# Altium project retroBreadboard_v1i1.PrjPCB
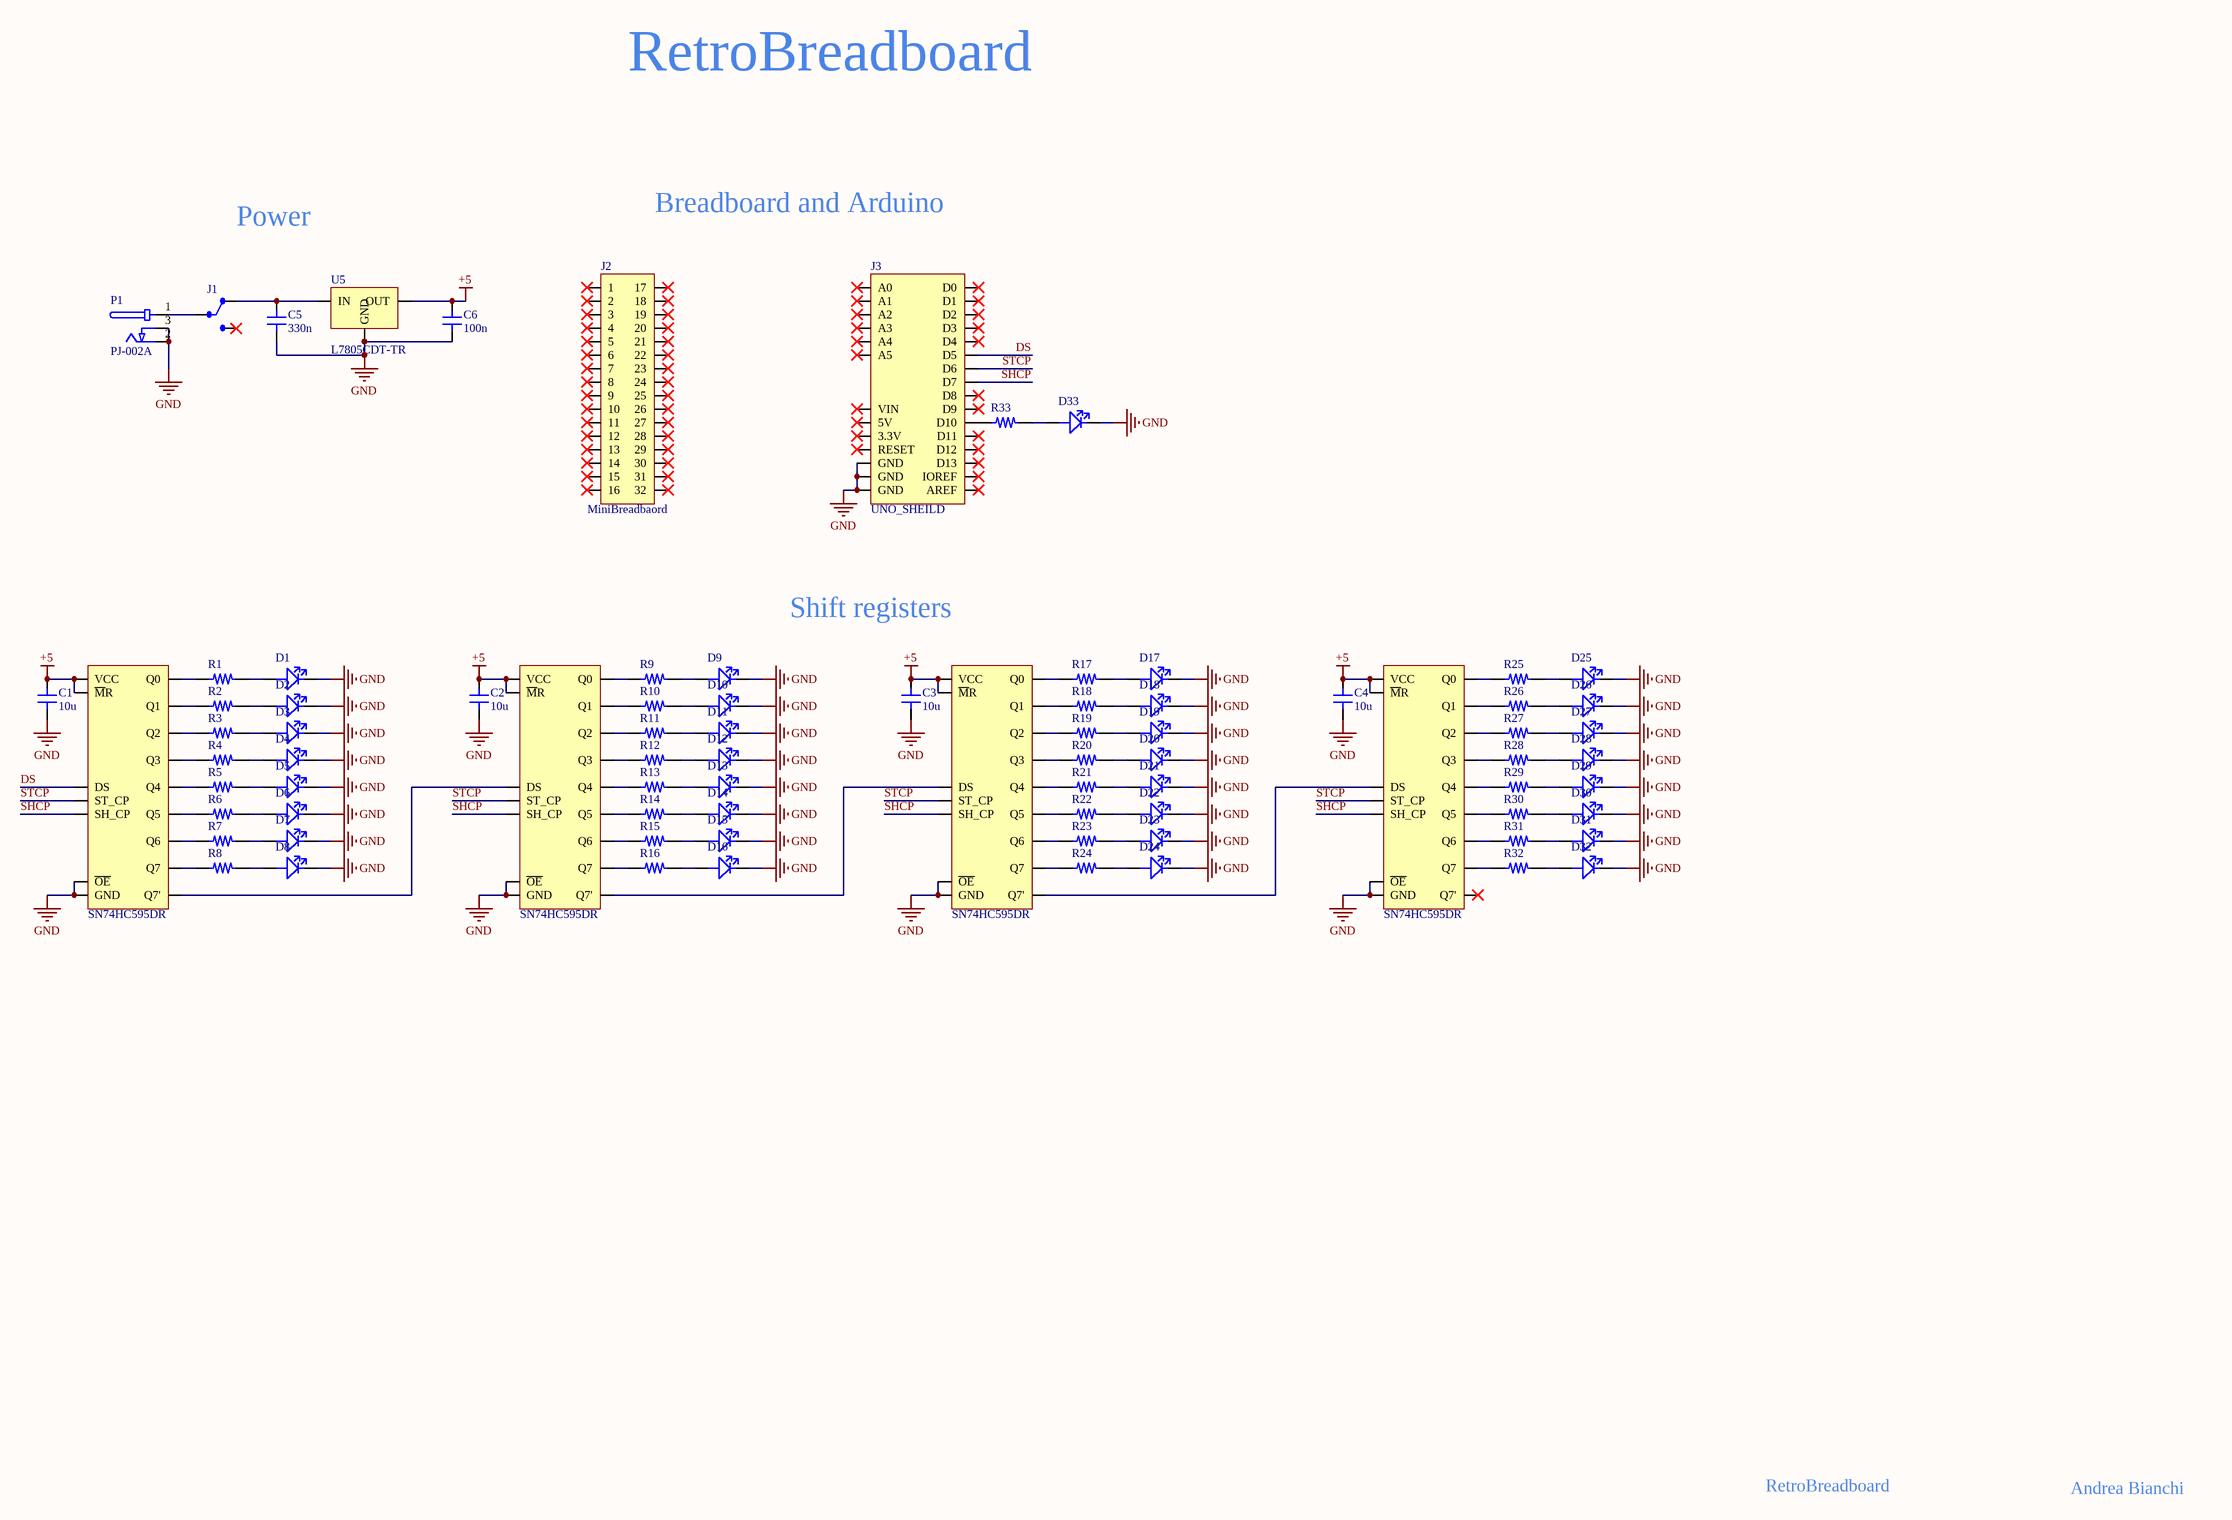
[diagram p0: retroBreadboard_v1i1.SchDoc]
1 sheet, 81 parts. Net scope: global (net labels, ports and power ports of the same name join across sheets).
Board files: retroBreadboard_v1i1.PcbDoc, retroBreadboard_v2i1.PcbDoc

## Sheet retroBreadboard_v1i1.SchDoc
size A2

### Parts
C1  10u  [C0805]
C2  10u  [C0805]
C3  10u  [C0805]
C4  10u  [C0805]
C5  330n  [C0805]
C6  100n  [C0805]
D1  VLMB1500-GS08  [VLMB1500-GS08]  (value not drawn)
D2  VLMB1500-GS08  [VLMB1500-GS08]  (value not drawn)
D3  VLMB1500-GS08  [VLMB1500-GS08]  (value not drawn)
D4  VLMB1500-GS08  [VLMB1500-GS08]  (value not drawn)
D5  VLMB1500-GS08  [VLMB1500-GS08]  (value not drawn)
D6  VLMB1500-GS08  [VLMB1500-GS08]  (value not drawn)
D7  VLMB1500-GS08  [VLMB1500-GS08]  (value not drawn)
D8  VLMB1500-GS08  [VLMB1500-GS08]  (value not drawn)
D9  VLMB1500-GS08  [VLMB1500-GS08]  (value not drawn)
D10  VLMB1500-GS08  [VLMB1500-GS08]  (value not drawn)
D11  VLMB1500-GS08  [VLMB1500-GS08]  (value not drawn)
D12  VLMB1500-GS08  [VLMB1500-GS08]  (value not drawn)
D13  VLMB1500-GS08  [VLMB1500-GS08]  (value not drawn)
D14  VLMB1500-GS08  [VLMB1500-GS08]  (value not drawn)
D15  VLMB1500-GS08  [VLMB1500-GS08]  (value not drawn)
D16  VLMB1500-GS08  [VLMB1500-GS08]  (value not drawn)
D17  VLMB1500-GS08  [VLMB1500-GS08]  (value not drawn)
D18  VLMB1500-GS08  [VLMB1500-GS08]  (value not drawn)
D19  VLMB1500-GS08  [VLMB1500-GS08]  (value not drawn)
D20  VLMB1500-GS08  [VLMB1500-GS08]  (value not drawn)
D21  VLMB1500-GS08  [VLMB1500-GS08]  (value not drawn)
D22  VLMB1500-GS08  [VLMB1500-GS08]  (value not drawn)
D23  VLMB1500-GS08  [VLMB1500-GS08]  (value not drawn)
D24  VLMB1500-GS08  [VLMB1500-GS08]  (value not drawn)
D25  VLMB1500-GS08  [VLMB1500-GS08]  (value not drawn)
D26  VLMB1500-GS08  [VLMB1500-GS08]  (value not drawn)
D27  VLMB1500-GS08  [VLMB1500-GS08]  (value not drawn)
D28  VLMB1500-GS08  [VLMB1500-GS08]  (value not drawn)
D29  VLMB1500-GS08  [VLMB1500-GS08]  (value not drawn)
D30  VLMB1500-GS08  [VLMB1500-GS08]  (value not drawn)
D31  VLMB1500-GS08  [VLMB1500-GS08]  (value not drawn)
D32  VLMB1500-GS08  [VLMB1500-GS08]  (value not drawn)
D33  VLMB1500-GS08  [VLMB1500-GS08]  (value not drawn)
J1  500SSP1S1M6QEA  [SLIDE SPDT]  (value not drawn)
J2  MiniBreadbaord  [MINI_BREADBOARD HOLE]
J3  UNO_SHEILD  [ARDUINO_UNO_SHIELD]
P1  PJ-002A  [PJ-002A]
R1  RC0402FR-07200RL  [RES0402]  (value not drawn)
R2  RC0402FR-07200RL  [RES0402]  (value not drawn)
R3  RC0402FR-07200RL  [RES0402]  (value not drawn)
R4  RC0402FR-07200RL  [RES0402]  (value not drawn)
R5  RC0402FR-07200RL  [RES0402]  (value not drawn)
R6  RC0402FR-07200RL  [RES0402]  (value not drawn)
R7  RC0402FR-07200RL  [RES0402]  (value not drawn)
R8  RC0402FR-07200RL  [RES0402]  (value not drawn)
R9  RC0402FR-07200RL  [RES0402]  (value not drawn)
R10  RC0402FR-07200RL  [RES0402]  (value not drawn)
R11  RC0402FR-07200RL  [RES0402]  (value not drawn)
R12  RC0402FR-07200RL  [RES0402]  (value not drawn)
R13  RC0402FR-07200RL  [RES0402]  (value not drawn)
R14  RC0402FR-07200RL  [RES0402]  (value not drawn)
R15  RC0402FR-07200RL  [RES0402]  (value not drawn)
R16  RC0402FR-07200RL  [RES0402]  (value not drawn)
R17  RC0402FR-07200RL  [RES0402]  (value not drawn)
R18  RC0402FR-07200RL  [RES0402]  (value not drawn)
R19  RC0402FR-07200RL  [RES0402]  (value not drawn)
R20  RC0402FR-07200RL  [RES0402]  (value not drawn)
R21  RC0402FR-07200RL  [RES0402]  (value not drawn)
R22  RC0402FR-07200RL  [RES0402]  (value not drawn)
R23  RC0402FR-07200RL  [RES0402]  (value not drawn)
R24  RC0402FR-07200RL  [RES0402]  (value not drawn)
R25  RC0402FR-07200RL  [RES0402]  (value not drawn)
R26  RC0402FR-07200RL  [RES0402]  (value not drawn)
R27  RC0402FR-07200RL  [RES0402]  (value not drawn)
R28  RC0402FR-07200RL  [RES0402]  (value not drawn)
R29  RC0402FR-07200RL  [RES0402]  (value not drawn)
R30  RC0402FR-07200RL  [RES0402]  (value not drawn)
R31  RC0402FR-07200RL  [RES0402]  (value not drawn)
R32  RC0402FR-07200RL  [RES0402]  (value not drawn)
R33  RC0402FR-07200RL  [RES0402]  (value not drawn)
U1  SN74HC595DR  [SOIC16]
U2  SN74HC595DR  [SOIC16]
U3  SN74HC595DR  [SOIC16]
U4  SN74HC595DR  [SOIC16]
U5  L7805CDT-TR  [DPAK]

### Nets
+5: C1.2 C2.2 C3.2 C4.2 C6.2 U1.10(~{M}R) U1.16(VCC) U2.10(~{M}R) U2.16(VCC) U3.10(~{M}R) U3.16(VCC) U4.10(~{M}R) U4.16(VCC) U5.3(OUT)
GND: C1.1 C2.1 C3.1 C4.1 C5.1 C6.1 D1.2(K) D2.2(K) D3.2(K) D4.2(K) D5.2(K) D6.2(K) D7.2(K) D8.2(K) D9.2(K) D10.2(K) D11.2(K) D12.2(K) D13.2(K) D14.2(K) D15.2(K) D16.2(K) D17.2(K) D18.2(K) D19.2(K) D20.2(K) D21.2(K) D22.2(K) D23.2(K) D24.2(K) D25.2(K) D26.2(K) D27.2(K) D28.2(K) D29.2(K) D30.2(K) D31.2(K) D32.2(K) D33.2(K) J3.15(GND) J3.24(GND) J3.25(GND) P1.2 P1.3 U1.8(GND) U1.13(~{OE}) U2.8(GND) U2.13(~{OE}) U3.8(GND) U3.13(~{OE}) U4.8(GND) U4.13(~{OE}) U5.4(GND)
DS: J3.6(D5) U1.14(DS)
SHCP: J3.8(D7) U1.11(SH_CP) U2.11(SH_CP) U3.11(SH_CP) U4.11(SH_CP)
STCP: J3.7(D6) U1.12(ST_CP) U2.12(ST_CP) U3.12(ST_CP) U4.12(ST_CP)
NetC5_2: C5.2 J1.1 U5.1(IN)
NetD1_1: D1.1(A) R1.2
NetD2_1: D2.1(A) R2.2
NetD3_1: D3.1(A) R3.2
NetD4_1: D4.1(A) R4.2
NetD5_1: D5.1(A) R5.2
NetD6_1: D6.1(A) R6.2
NetD7_1: D7.1(A) R7.2
NetD8_1: D8.1(A) R8.2
NetD9_1: D9.1(A) R9.2
NetD10_1: D10.1(A) R10.2
NetD11_1: D11.1(A) R11.2
NetD12_1: D12.1(A) R12.2
NetD13_1: D13.1(A) R13.2
NetD14_1: D14.1(A) R14.2
NetD15_1: D15.1(A) R15.2
NetD16_1: D16.1(A) R16.2
NetD17_1: D17.1(A) R17.2
NetD18_1: D18.1(A) R18.2
NetD19_1: D19.1(A) R19.2
NetD20_1: D20.1(A) R20.2
NetD21_1: D21.1(A) R21.2
NetD22_1: D22.1(A) R22.2
NetD23_1: D23.1(A) R23.2
NetD24_1: D24.1(A) R24.2
NetD25_1: D25.1(A) R25.2
NetD26_1: D26.1(A) R26.2
NetD27_1: D27.1(A) R27.2
NetD28_1: D28.1(A) R28.2
NetD29_1: D29.1(A) R29.2
NetD30_1: D30.1(A) R30.2
NetD31_1: D31.1(A) R31.2
NetD32_1: D32.1(A) R32.2
NetD33_1: D33.1(A) R33.2
NetJ1_2: J1.2 P1.1
NetJ3_11: J3.11(D10) R33.1
NetR1_1: R1.1 U1.15(Q0)
NetR2_1: R2.1 U1.1(Q1)
NetR3_1: R3.1 U1.2(Q2)
NetR4_1: R4.1 U1.3(Q3)
NetR5_1: R5.1 U1.4(Q4)
NetR6_1: R6.1 U1.5(Q5)
NetR7_1: R7.1 U1.6(Q6)
NetR8_1: R8.1 U1.7(Q7)
NetR9_1: R9.1 U2.15(Q0)
NetR10_1: R10.1 U2.1(Q1)
NetR11_1: R11.1 U2.2(Q2)
NetR12_1: R12.1 U2.3(Q3)
NetR13_1: R13.1 U2.4(Q4)
NetR14_1: R14.1 U2.5(Q5)
NetR15_1: R15.1 U2.6(Q6)
NetR16_1: R16.1 U2.7(Q7)
NetR17_1: R17.1 U3.15(Q0)
NetR18_1: R18.1 U3.1(Q1)
NetR19_1: R19.1 U3.2(Q2)
NetR20_1: R20.1 U3.3(Q3)
NetR21_1: R21.1 U3.4(Q4)
NetR22_1: R22.1 U3.5(Q5)
NetR23_1: R23.1 U3.6(Q6)
NetR24_1: R24.1 U3.7(Q7)
NetR25_1: R25.1 U4.15(Q0)
NetR26_1: R26.1 U4.1(Q1)
NetR27_1: R27.1 U4.2(Q2)
NetR28_1: R28.1 U4.3(Q3)
NetR29_1: R29.1 U4.4(Q4)
NetR30_1: R30.1 U4.5(Q5)
NetR31_1: R31.1 U4.6(Q6)
NetR32_1: R32.1 U4.7(Q7)
NetU1_9: U1.9(Q7') U2.14(DS)
NetU2_9: U2.9(Q7') U3.14(DS)
NetU3_9: U3.9(Q7') U4.14(DS)

Not connected (* = marked no-connect by the designer): J1 3*; J2 1* 2* 3* 4* 5* 6* 7* 8* 9* 10* 11* 12* 13* 14* 15* 16* 17* 18* 19* 20* 21* 22* 23* 24* 25* 26* 27* 28* 29* 30* 31* 32*; J3 1(D0)* 2(D1)* 3(D2)* 4(D3)* 5(D4)* 9(D8)* 10(D9)* 12(D11)* 13(D12)* 14(D13)* 16(AREF)* 17(A5)* 18(A4)* 19(A3)* 20(A2)* 21(A1)* 22(A0)* 23(VIN)* 26(5V)* 27(3.3V)* 28(RESET)* 29(IOREF)*; U4 9(Q7')*

### Notes on the sheet
- RetroBreadboard
- Power
- Breadboard and Arduino
- Shift registers
- Andrea Bianchi
- Title
- Size:
- Date:
- File:
- A2
- Number:
- Time:
- Revision:
- Sheet
- of

### Library data of the parts
C1-C4 = C0805_10u: Manufacturer: Samsung; Manufacturer Part Number: CL21A106KQFNNNG; Material: Ceramic; Tolerance: 10%; Capacitance: 10uF; Voltage Rating: 6.3V; Dielectric: X5R; Supplier 1: Digi-Key; Stock 1: 53378; RoHS: Yes; Mount: Surface Mount; Case/Package: 0805; Case Code (Metric): 2012; Case Code (Imperial): 0805; Min Operating Temperature: -55°C; Max Operating Temperature: 85°C; Packaging: Tape and Reel; Package Quantity: 3000; Voltage: 6.3V; Length: 2mm; Height: 1.25mm; Width: 0.049inch; Thickness: 0.053inch; Depth: 1.25mm; Lead Free: Lead Free; ComponentLink1URL: http://www.samsungsem.com/kr/support/product-search/mlcc/CL21A106KQFNNNG.jsp?src-supplier=Digi-Key; ComponentLink1Description: http://www.samsungsem.com/kr/support/product-search/mlcc/CL21A106KQFNNNG.jsp?src-supplier=Digi-Key; ComponentLink2URL: https://produktinfo.conrad.com/datenblaetter/450000-474999/454985-da-01-en-VS_KONDENSATOR_0805.pdf?src-supplier=Conrad; ComponentLink2Description: https://produktinfo.conrad.com/datenblaetter/450000-474999/454985-da-01-en-VS_KONDENSATOR_0805.pdf?src-supplier=Conrad; Supplier Part Number 1: 1276-6457-1-ND; Pricing 1: 1 = 0.13000, 10 = 0.09600, 100 = 0.04270, 500 = 0.03054, 1000 = 0.02399 (USD)
C5 = C0805_330n: Manufacturer: Samsung; Manufacturer Part Number: CL21B334KAFNNNG; Material: Ceramic; Tolerance: 10%; Capacitance: 330nF; Voltage Rating: 25V; Dielectric: X7R; Supplier 1: Digi-Key; Stock 1: 834; RoHS: Yes; Mount: Surface Mount; Case/Package: 0805; Case Code (Metric): 2012; Case Code (Imperial): 0805; Min Operating Temperature: -55°C; Max Operating Temperature: 125°C; Package Quantity: 3000; Packaging: Tape and Reel; Voltage: 25V; Length: 2mm; Height: 1.25mm; Width: 0.049inch; Thickness: 0.053inch; Depth: 1.25mm; Lead Free: Lead Free; ComponentLink1URL: https://www.distrelec.biz/Web/Downloads/_e/ng/MLCC_CatalogDownload2013_ENG.pdf?mime=application%2Fpdf&src-supplier=Distrelec; ComponentLink1Description: https://www.distrelec.biz/Web/Downloads/_e/ng/MLCC_CatalogDownload2013_ENG.pdf?mime=application%2Fpdf&src-supplier=Distrelec; ComponentLink2URL: http://www.samsungsem.com/global/support/library/product-catalog/__icsFiles/afieldfile/2014/11/13/MLCC.pdf?src-supplier=Digi-Key; ComponentLink2Description: http://www.samsungsem.com/global/support/library/product-catalog/__icsFiles/afieldfile/2014/11/13/MLCC.pdf?src-supplier=Digi-Key; ComponentLink3URL: http://www1.futureelectronics.com/doc/SAMSUNG%20PASSIVE/CL05B104KQ5NNNC.pdf?src-supplier=Future+Electronics; ComponentLink3Description: http://www1.futureelectronics.com/doc/SAMSUNG%20PASSIVE/CL05B104KQ5NNNC.pdf?src-supplier=Future+Electronics; Supplier Part Number 1: 1276-6479-1-ND; Pricing 1: 1 = 0.12000, 10 = 0.08600, 100 = 0.03810, 500 = 0.02722, 1000 = 0.02138 (USD)
C6 = C0805_100n: Manufacturer: Samsung; Manufacturer Part Number: CL21F104ZBCNNNC; Material: Ceramic; Capacitance: 100nF; Tolerance: 80%; Dielectric: Y5V; Voltage Rating: 50V; Supplier 1: Digi-Key; Stock 1: 117334; RoHS: Yes; Mount: Surface Mount; Case/Package: 0805; Case Code (Metric): 2012; Case Code (Imperial): 0805; Min Operating Temperature: -30°C; Max Operating Temperature: 85°C; Packaging: Tape and Reel; Package Quantity: 1; Length: 2mm; Height: 0.85mm; Width: 0.049inch; Thickness: 0.037inch; Depth: 1.25mm; Radiation Hardening: No; ComponentLink1URL: https://www.verical.com/server-webapp/html/getDatasheet?partID=466953&src-supplier=Verical; ComponentLink1Description: https://www.verical.com/server-webapp/html/getDatasheet?partID=466953&src-supplier=Verical; ComponentLink2URL: https://produktinfo.conrad.com/datenblaetter/450000-474999/454191-da-01-en-VS_KONDENSATOR_0805.pdf?src-supplier=Conrad; ComponentLink2Description: https://produktinfo.conrad.com/datenblaetter/450000-474999/454191-da-01-en-VS_KONDENSATOR_0805.pdf?src-supplier=Conrad; Supplier Part Number 1: 1276-1007-1-ND; Pricing 1: 1 = 0.10000, 10 = 0.04400, 100 = 0.01950, 500 = 0.01390, 1000 = 0.01092 (USD)
D1-D33 = VLMB1500-GS08: Standard LEDs - SMD 0402 BLUE Non-Diff; Manufacturer: Vishay; Lens Colour: Clear; Luminous Intensity: 45mcd; Forward Current: 30mA; Viewing Angle: 130°; Forward Voltage: 3.15V; Dominant Wavelength: 470nm; Test Current: 5mA; Number of Elements: 1; Power Dissipation: 76mW; Lens Style: Rectangular; Power Rating: 75mW; Supplier 1: Digi-Key; Manufacturer Part Number: VLMB1500-GS08; Stock 1: 322508; Mount: Surface Mount; Case/Package: 0402; Number of Pins: 2; Colour: Blue; Case Code (Metric): 1005; Case Code (Imperial): 0402; Contact Plating: Matte,Tin; Min Operating Temperature: -30°C; Max Operating Temperature: 80°C; Packaging: Tape and Reel; Package Quantity: 1; Illumination Colour: Blue; Max Power Dissipation: 76mW; Number of LEDs: 1; Length: 1mm; Height: 0.35mm; Width: 0.5mm; Depth: 0.5mm; Radiation Hardening: No; REACH SVHC: Unknown; Lead Free: Lead Free; ComponentLink1URL: http://www.vishay.com/docs/82554/vlmo1500.pdf; ComponentLink1Description: http://www.vishay.com/docs/82554/vlmo1500.pdf; Supplier Part Number 1: VLMB1500-GS08DKR-ND; Pricing 1: 1=0.41, 10=0.292, 25=0.2532, 100=0.1949, 250=0.15836, 500=0.11696, 1000=0.09746 (USD)
J1 = SLIDE SPDT: SWITCH SLIDE SPDT 5A 120V; Manufacturer: E-Switch; Mechanical Life: 30000Cycles; Actuator Material: Nylon,Polyamide; Max Voltage Rating (AC): 250V; Voltage Rating (DC): 28V; Contact Resistance: 10mR; Switch Travel: 2.16mm; Switch Function: On-On; Actuator Length: 4.72mm; Supplier 1: Digi-Key; Manufacturer Part Number: 500SSP1S1M6QEA; Stock 1: 6111; Mount: Through Hole,Brackets; Contact Plating: Silver; Contact Material: Copper,Silver,Copper Alloy; Housing Material: Stainless Steel; Min Operating Temperature: -30°C; Max Operating Temperature: 85°C; Contact Current Rating: 5A; Voltage Rating (AC): 120V; Throw Configuration: SPDT; Package Quantity: 1; Packaging: Bulk; Current Rating: 5A; Max Voltage Rating (DC): 28V; Termination: PC Pin; Electrical Life: 30000Cycles; Orientation: Right Angle; REACH SVHC: Unknown; Lead Free: Lead Free; Flammability Rating: UL94 V-0; ComponentLink1URL: https://datasheet.ciiva.com/16337/500-16337624.pdf; ComponentLink1Description: https://datasheet.ciiva.com/16337/500-16337624.pdf; ComponentLink2URL: https://datasheet.ciiva.com/16174/35500-16174234.pdf; ComponentLink2Description: https://datasheet.ciiva.com/16174/35500-16174234.pdf; ComponentLink3URL: https://datasheet.ciiva.com/2889/t511006d-2889419.pdf; ComponentLink3Description: https://datasheet.ciiva.com/2889/t511006d-2889419.pdf; Supplier Part Number 1: EG2478-ND; Pricing 1: 1=2.93, 10=2.808, 25=2.7484, 50=2.39, 100=2.3303, 250=2.27052, 500=1.912, 1000=1.7925, 5000=1.64313 (USD)
J2 = MINI_BREADBOARD: Mini Breadboard; Manufacturer: TE Connectivity AMP; Manufacturer Part Number: 1738132-1; Gender: Male; Supplier 1: Digi-Key; Stock 1: 0; Colour: Natural; ComponentLink1URL: http://www.te.com/commerce/DocumentDelivery/DDEController?Action=srchrtrv&DocNm=1738132&DocType=Customer+Drawing&DocLang=English; ComponentLink1Description: http://www.te.com/commerce/DocumentDelivery/DDEController?Action=srchrtrv&DocNm=1738132&DocType=Customer+Drawing&DocLang=English; Supplier Part Number 1: 1738132-1-ND
J3 = ARDUINO_UNO_SHIELD
P1 = PJ-002A: PJ-002 Series 2 x 6.5 mm 16 V Right Angle Through Hole Power Jack; Manufacturer: CUI; Gender: Male; Shielding: Unshielded; Current Rating: 2.5A; Voltage Rating: 24V; Insulation Resistance: 50MR; Number of Conductors: 2; Supplier 1: Digi-Key; Manufacturer Part Number: PJ-002A; Stock 1: 133077; Mount: Through Hole; Contact Material: Copper,Copper Alloy; Contact Plating: Nickel,Tin; Housing Colour: Black; Housing Material: Thermoplastic; Colour: Black; Min Operating Temperature: -25°C; Max Operating Temperature: 85°C; Termination: Through Hole; Connector Type: Jack; Packaging: Bulk; Package Quantity: 500; Contact Gender: Male; Orientation: Horizontal; Diameter: 2.1mm; Lead Free: Lead Free; Flammability Rating: UL94 V-0; ComponentLink1URL: http://www.cui.com/product/resource/digikeypdf/pj-002a.pdf; ComponentLink1Description: http://www.cui.com/product/resource/digikeypdf/pj-002a.pdf; ComponentLink2URL: http://www.cui.com/Product/Resource/FuturePDF/PJ-002A.pdf; ComponentLink2Description: http://www.cui.com/Product/Resource/FuturePDF/PJ-002A.pdf; ComponentLink3URL: http://www.mouser.com/ds/2/670/pj-002a-515880.pdf; ComponentLink3Description: http://www.mouser.com/ds/2/670/pj-002a-515880.pdf; Supplier Part Number 1: CP-002A-ND
R1-R33 = R0402_200: RES SMD 200 OHM 1% 1/16W 0402; Manufacturer: Yageo; Resistance: 200R; Power Rating: 63mW; Voltage Rating: 50V; Temperature Coefficient: 100ppm/°C; Supplier 1: Digi-Key; Manufacturer Part Number: RC0402FR-07200RL; Stock 1: 7546584; RoHS: Yes; Case/Package: 0402; Case Code (Metric): 1005; Case Code (Imperial): 0402; Min Operating Temperature: -55°C; Max Operating Temperature: 155°C; Tolerance: 1%; Packaging: Tape and Reel; Package Quantity: 1; Composition: Thick Film; Number of Terminations: 2; Termination: SMD/SMT; Military Standard: Not; Max Power Dissipation: 63mW; Voltage Rating (DC): 50V; Features: Moisture Resistant; Length: 1mm; Height: 0.016inch; Width: 0.02inch; Depth: 0.5mm; REACH SVHC: No SVHC; Lead Free: Lead Free; ComponentLink1URL: http://www.yageo.com/documents/recent/PYu-RC_Group_51_RoHS_L_10.pdf?src-supplier=Digi-Key; ComponentLink1Description: http://www.yageo.com/documents/recent/PYu-RC_Group_51_RoHS_L_10.pdf?src-supplier=Digi-Key; ComponentLink2URL: http://www.farnell.com/datasheets/1018594.pdf?src-supplier=Element14; ComponentLink2Description: http://www.farnell.com/datasheets/1018594.pdf?src-supplier=Element14; ComponentLink3URL: http://www.yageo.com/documents/recent/PYu-RC0402_51_RoHS_L_6_r.pdf?src-supplier=Future+Electronics; ComponentLink3Description: http://www.yageo.com/documents/recent/PYu-RC0402_51_RoHS_L_6_r.pdf?src-supplier=Future+Electronics; ComponentLink4URL: https://www.verical.com/server-webapp/html/getDatasheet?partID=331152&src-supplier=Verical; ComponentLink4Description: https://www.verical.com/server-webapp/html/getDatasheet?partID=331152&src-supplier=Verical; ComponentLink5URL: http://www.farnell.com/datasheets/2167052.pdf?src-supplier=Element14; ComponentLink5Description: http://www.farnell.com/datasheets/2167052.pdf?src-supplier=Element14; ComponentLink6URL: http://www.yageo.com/documents/recent/PYu-RC0402_51_RoHS_L_6_r.pdf?src-supplier=Mouser; ComponentLink6Description: http://www.yageo.com/documents/recent/PYu-RC0402_51_RoHS_L_6_r.pdf?src-supplier=Mouser; Supplier Part Number 1: 311-200LRCT-ND; Pricing 1: 1 = 0.10000, 10 = 0.01600, 100 = 0.00670, 1000 = 0.00301, 2500 = 0.00261, 5000 = 0.00215 (USD)
U1-U4 = 74HC595: IC, SM, LOGIC, 74HC, REGISTER; Manufacturer: Texas Instruments; Direction: Unidirectional; Max Supply Voltage: 6V; Min Supply Voltage: 2V; Propagation Delay: 250ns; Logic Function: Shift Register; Number of Elements: 1; Operating Supply Voltage: 5V; Frequency: 42MHz; Number of Circuits: 4; Number of Bits: 8; Number of Output Lines: 10; Max Input Current: 1uA; Quiescent Current: 8uA; Supplier 1: Digi-Key; Manufacturer Part Number: SN74HC595DR; Stock 1: 53061; Mount: Surface Mount; Case/Package: SOIC; Number of Pins: 16; Weight: 0.004998oz; Contact Plating: Gold; Min Operating Temperature: -40°C; Max Operating Temperature: 85°C; Packaging: Tape and Reel; Package Quantity: 2500; Number of Bits per Element: 8; Turn-On Delay Time: 250ns; Termination: SMD/SMT; Length: 9.9mm; Height: 1.58mm; Width: 3.91mm; Radiation Hardening: No; REACH SVHC: No SVHC; Lead Free: Lead Free; ComponentLink1URL: http://www.ti.com/lit/ds/symlink/sn74hc595.pdf; ComponentLink1Description: http://www.ti.com/lit/ds/symlink/sn74hc595.pdf; ComponentLink2URL: http://www.farnell.com/datasheets/1831198.pdf; ComponentLink2Description: http://www.farnell.com/datasheets/1831198.pdf; ComponentLink3URL: http://www.farnell.com/datasheets/1886142.pdf; ComponentLink3Description: http://www.farnell.com/datasheets/1886142.pdf; ComponentLink4URL: https://www.verical.com/server-webapp/html/getDatasheet?partID=134875; ComponentLink4Description: https://www.verical.com/server-webapp/html/getDatasheet?partID=134875; ComponentLink5URL: http://www.farnell.com/datasheets/1905810.pdf; ComponentLink5Description: http://www.farnell.com/datasheets/1905810.pdf; ComponentLink6URL: http://www.ti.com/general/docs/lit/getliterature.tsp?genericPartNumber=SN54HC595-SP&&fileType=pdf; ComponentLink6Description: http://www.ti.com/general/docs/lit/getliterature.tsp?genericPartNumber=SN54HC595-SP&&fileType=pdf; ComponentLink7URL: http://www.jameco.com/Jameco/Products/ProdDS/916385.pdf; ComponentLink7Description: http://www.jameco.com/Jameco/Products/ProdDS/916385.pdf; ComponentLink8URL: http://www.farnell.com/datasheets/2020588.pdf; ComponentLink8Description: http://www.farnell.com/datasheets/2020588.pdf; ComponentLink9URL: http://datasheet.iiic.cc/texas_instruments/SN74HC595DR.pdf; ComponentLink9Description: http://datasheet.iiic.cc/texas_instruments/SN74HC595DR.pdf; Supplier Part Number 1: 296-14857-6-ND; Pricing 1: 1=0.51, 10=0.433, 100=0.323, 500=0.2538, 1000=0.19611 (USD)
U5 = L7805CDT-TR: IC REG LDO 5V 1.5A DPAK; Manufacturer: STMicroelectronics; Dropout Voltage: 2V; Number of Outputs: 1; Max Input Voltage: 35V; Min Input Voltage: 7V; Polarity: Positive; Quiescent Current: 8mA; Power Supply Rejection Ratio (PSRR): 62dB; Supplier 1: Digi-Key; Manufacturer Part Number: L7805CDT-TR; Stock 1: 7500; Mount: Surface Mount; Case/Package: TO-252; Number of Pins: 3; Contact Plating: Tin,Matte; Min Operating Temperature: 0°C; Max Operating Temperature: 125°C; Package Quantity: 1; Packaging: Tape and Reel; Max Output Current: 1.5A; Output Voltage: 5V; Output Current: 1.5A; Number of Regulators: 1; Min Output Voltage: 5V; Length: 6.6mm; Height: 2.4mm; Width: 6.2mm; Radiation Hardening: No; Lead Free: Lead Free; ComponentLink1URL: https://datasheet.ciiva.com/2042/cd00000444-2042784.pdf; ComponentLink1Description: https://datasheet.ciiva.com/2042/cd00000444-2042784.pdf; ComponentLink2URL: https://datasheet.ciiva.com/2042/cd00000444-2042785.pdf; ComponentLink2Description: https://datasheet.ciiva.com/2042/cd00000444-2042785.pdf; ComponentLink3URL: https://datasheet.ciiva.com/16357/cd00000444-16357893.pdf; ComponentLink3Description: https://datasheet.ciiva.com/16357/cd00000444-16357893.pdf; ComponentLink4URL: https://datasheet.ciiva.com/4882/cd00000444-4882231.pdf; ComponentLink4Description: https://datasheet.ciiva.com/4882/cd00000444-4882231.pdf; ComponentLink5URL: https://datasheet.ciiva.com/17360/cd00000444-17360220.pdf; ComponentLink5Description: https://datasheet.ciiva.com/17360/cd00000444-17360220.pdf; ComponentLink6URL: https://datasheet.ciiva.com/2042/cd00000444-2042783.pdf; ComponentLink6Description: https://datasheet.ciiva.com/2042/cd00000444-2042783.pdf; ComponentLink7URL: https://datasheet.ciiva.com/26904/l7805cdt-tr-26904768.pdf; ComponentLink7Description: https://datasheet.ciiva.com/26904/l7805cdt-tr-26904768.pdf; Supplier Part Number 1: 497-7255-2-ND